# EAGLE design bp_pic_programmer_v1 (EAGLE 5.07)
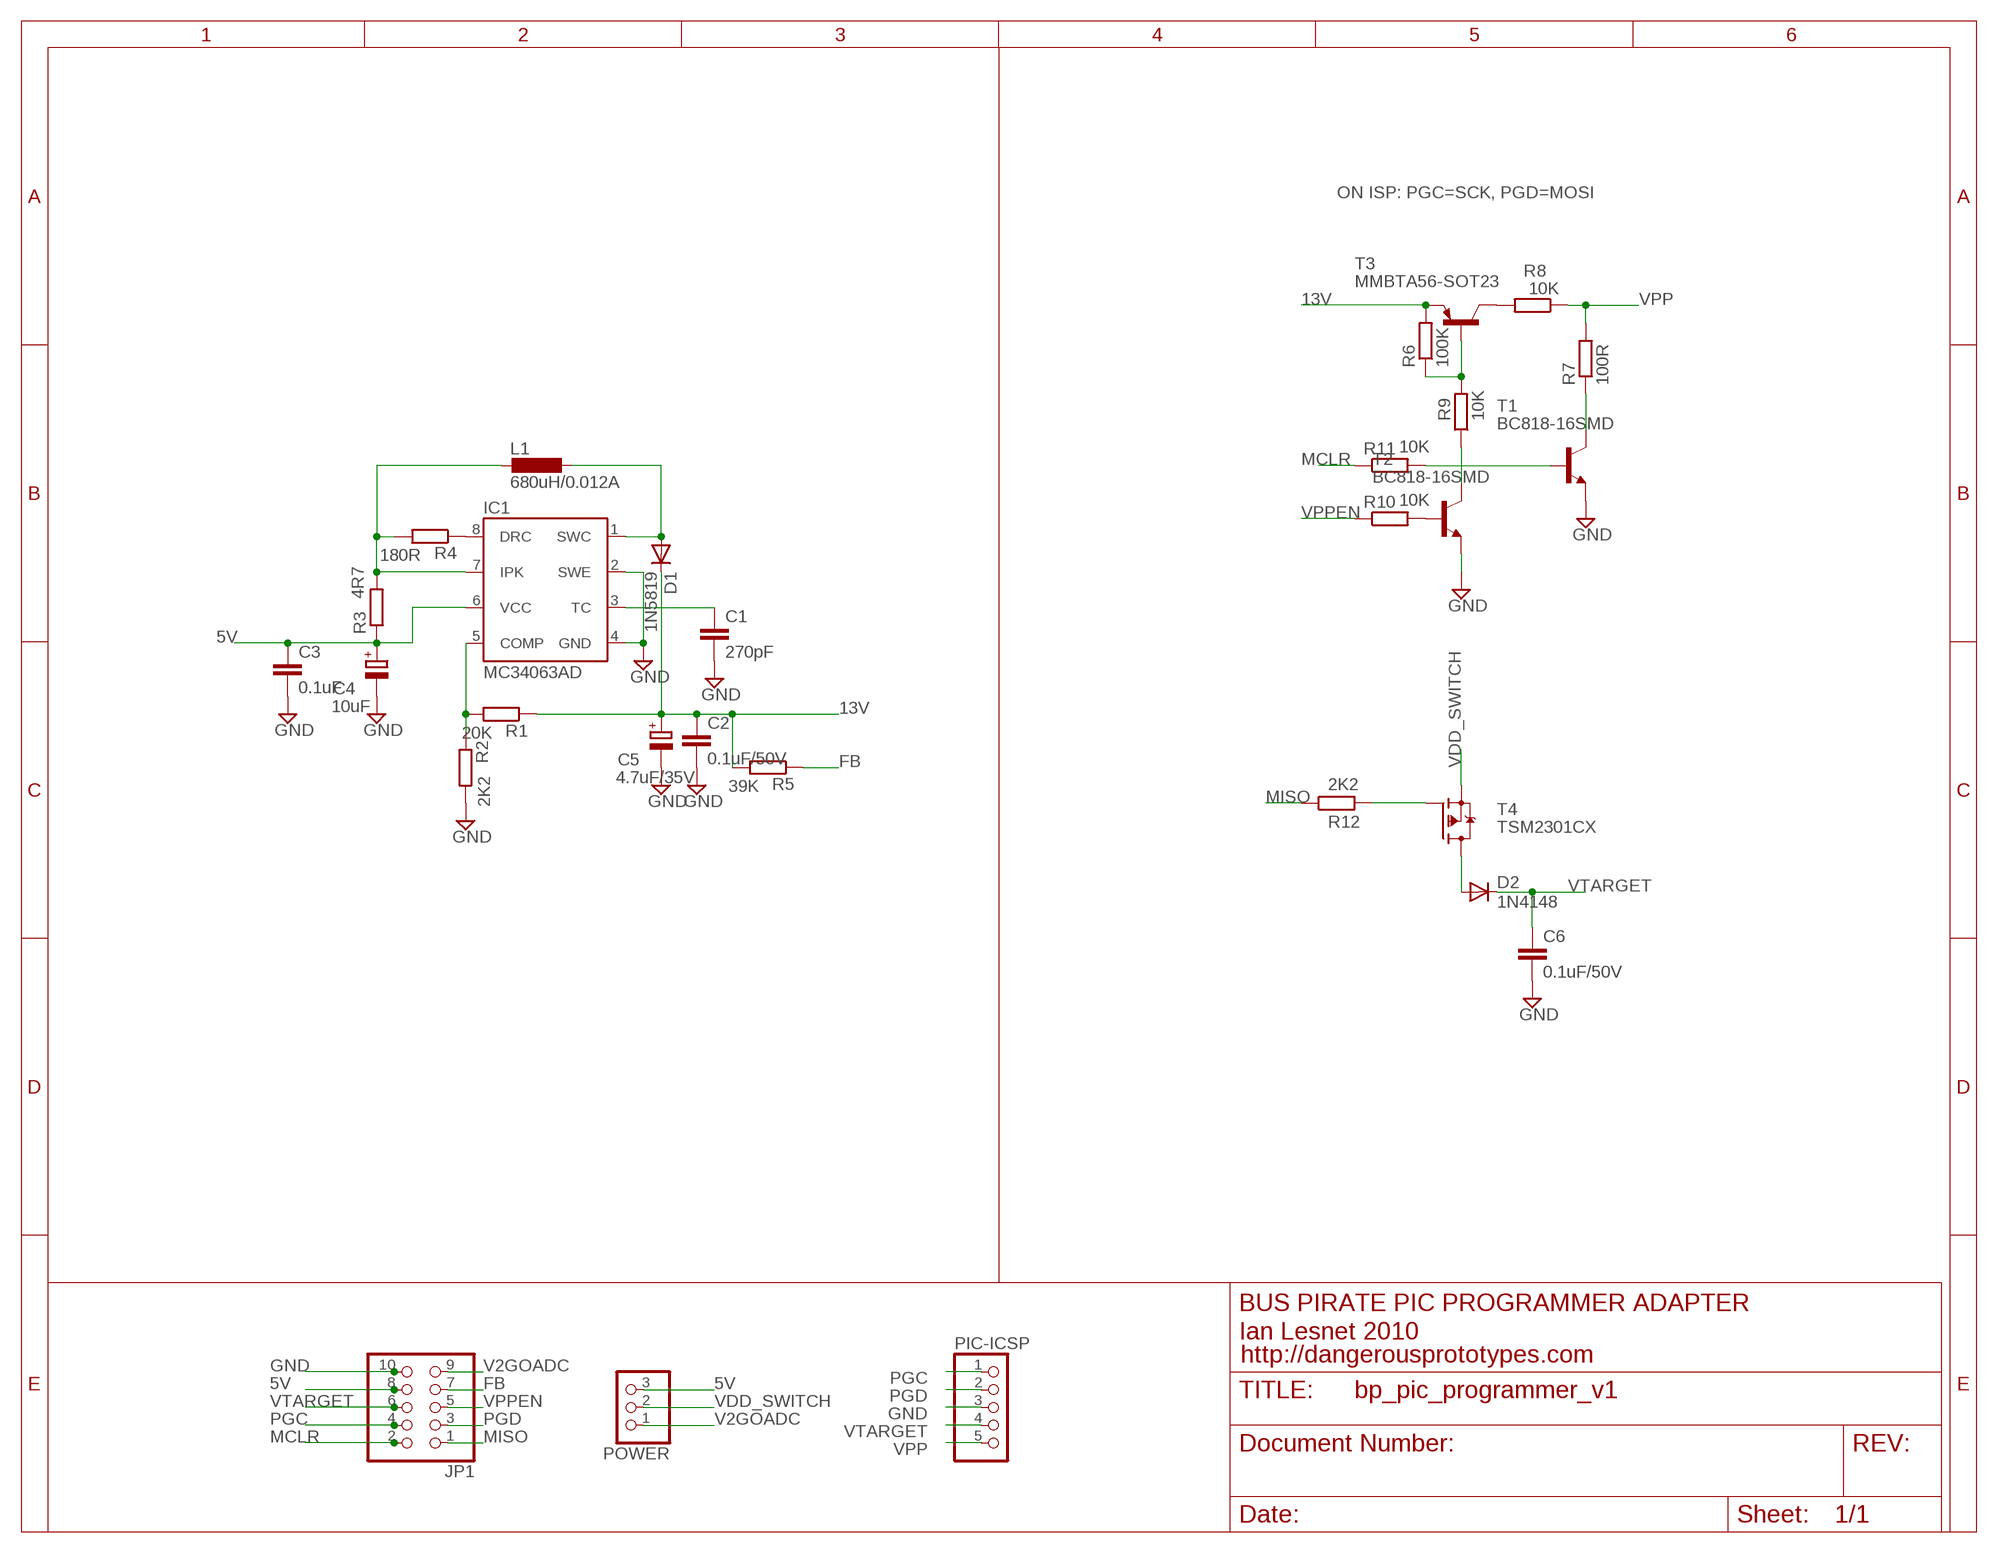
[diagram p0: schematic, sheet 1]

## Parts
C1  270pF  C-EUC0805K  [C0805K]
C2  0.1uF/50V  C-EUC0805K  [C0805K]
C3  0.1uF  C-EUC0805K  [C0805K]
C4  10uF  CPOL-EUSMCA  [SMC_A]
C5  4.7uF/35V  CPOL-EUSANYO_SMD_A5  [SANYO-OSCON_SMD_A5]
C6  0.1uF/50V  C-EUC0805K  [C0805K]
D1  1N5819  MBR0520LT  [SOD123]
D2  1N4148  DIODEDO323  [DO323]
IC1  MC34063AD  [SO08]
JP1  PINHD-2X5  [2X05]
L1  680uH/0.012A  L-EUL4532P  [L4532P]
PIC-ICSP  PINHD-1X5  [1X05]
POWER  PINHD-1X3  [1X03]
R1  20K  R-EU_M0805  [M0805]
R2  2K2  R-EU_M0805  [M0805]
R3  4R7  R-EU_M0805  [M0805]
R4  180R  R-EU_M0805  [M0805]
R5  39K  R-EU_M0805  [M0805]
R6  100K  R-EU_M0805  [M0805]
R7  100R  R-EU_M0805  [M0805]
R8  10K  R-EU_M0805  [M0805]
R9  10K  R-EU_M0805  [M0805]
R10  10K  R-EU_M0805  [M0805]
R11  10K  R-EU_M0805  [M0805]
R12  2K2  R-EU_M0805  [M0805]
T1  BC818-16SMD  [SOT23-BEC]
T2  BC818-16SMD  [SOT23-BEC]
T3  MMBTA56-SOT23  [SOT23]
T4  TSM2301CX  [SOT23]

## Nets
5V: C3.1 C4.+ IC1.6(VCC) JP1.8 POWER.3 R3.1
13V: C2.1 C5.+ D1.C R1.1 R5.2 R6.2 T3.2(E)
FB: JP1.7 R5.1
GND: C1.2 C2.2 C3.2 C4.- C5.- C6.2 IC1.2(SWE) IC1.4(GND) JP1.10 PIC-ICSP.3 R2.2 T1.E T2.E
MCLR: JP1.2 R11.1
MISO: JP1.1 R12.1
N$1: R12.2 T4.1(G)
N$3: R7.1 T1.C
N$4: R8.2 T3.3(C)
N$5: R9.1 T2.C
N$6: R6.1 R9.2 T3.1(B)
N$7: R11.2 T1.B
N$8: R10.2 T2.B
N$9: IC1.8(DRC) R4.1
N$10: D2.A T4.3(D)
N$11: IC1.7(IPK) L1.2 R3.2 R4.2
N$14: IC1.5(COMP) R1.2 R2.1
N$17: D1.A IC1.1(SWC) L1.1
N$19: C1.1 IC1.3(TC)
PGC: JP1.4 PIC-ICSP.5
PGD: JP1.3 PIC-ICSP.4
V2GOADC: JP1.9 POWER.1
VDD_SWITCH: POWER.2 T4.2(S)
VPP: PIC-ICSP.1 R7.2 R8.1
VPPEN: JP1.5 R10.1
VTARGET: C6.1 D2.C JP1.6 PIC-ICSP.2

## Notes on the sheet
- ON ISP: PGC=SCK, PGD=MOSI
- BUS PIRATE PIC PROGRAMMER ADAPTER
- Ian Lesnet 2010
- http://dangerousprototypes.com

## Library data of the parts
C1-C3 C6 = rcl:C-EU: CAPACITOR, European symbol
C4 C5 = rcl:CPOL-EU: POLARIZED CAPACITOR, European symbol
D1 = diode:MBR0520LT: SCHOTTKY BARRIER RECTIFIER Source: http://onsemi.com .. MBR0520LT1-D.pdf
D2 = DP-EagleLibrary:DIODE
IC1 = v-reg-3:MC34063A: 1.5A Step-Up/Down/Inverting Switching Regulator NPN Darlington Switch, Vin 3V to 40V, Current Limiter Input, adjustable Frequency up to 100kHz
JP1 = pinhead-2:PINHD-2X5: PIN HEADER
L1 = rcl:L-EU: INDUCTOR, European symbol
PIC-ICSP = pinhead-2:PINHD-1X5: PIN HEADER
POWER = pinhead-2:PINHD-1X3: PIN HEADER
R1-R12 = rcl:R-EU_: RESISTOR, European symbol
T1 T2 = transistor-npn:BC818*: NPN Transistor
T3 = transistor-pnp:*-?: PNP Transistor
T4 = dp_devices:TSM2301CX: 20V P-Channel Enhancement Mode MOSFET

## Board
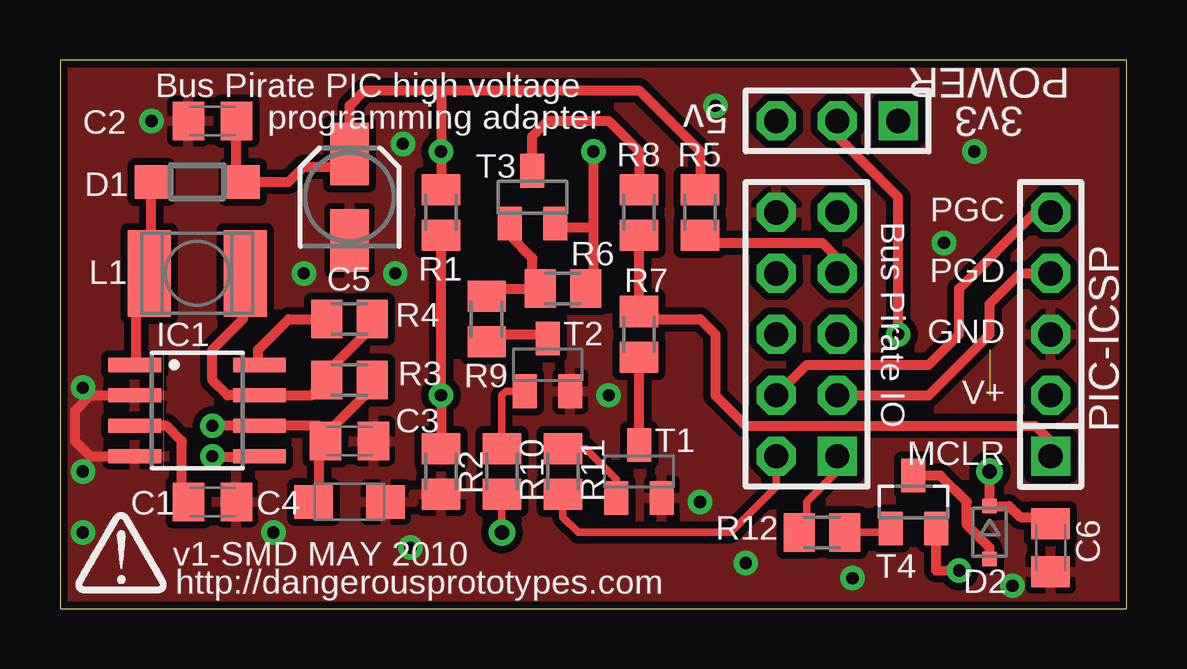
[diagram p1: board, top side]
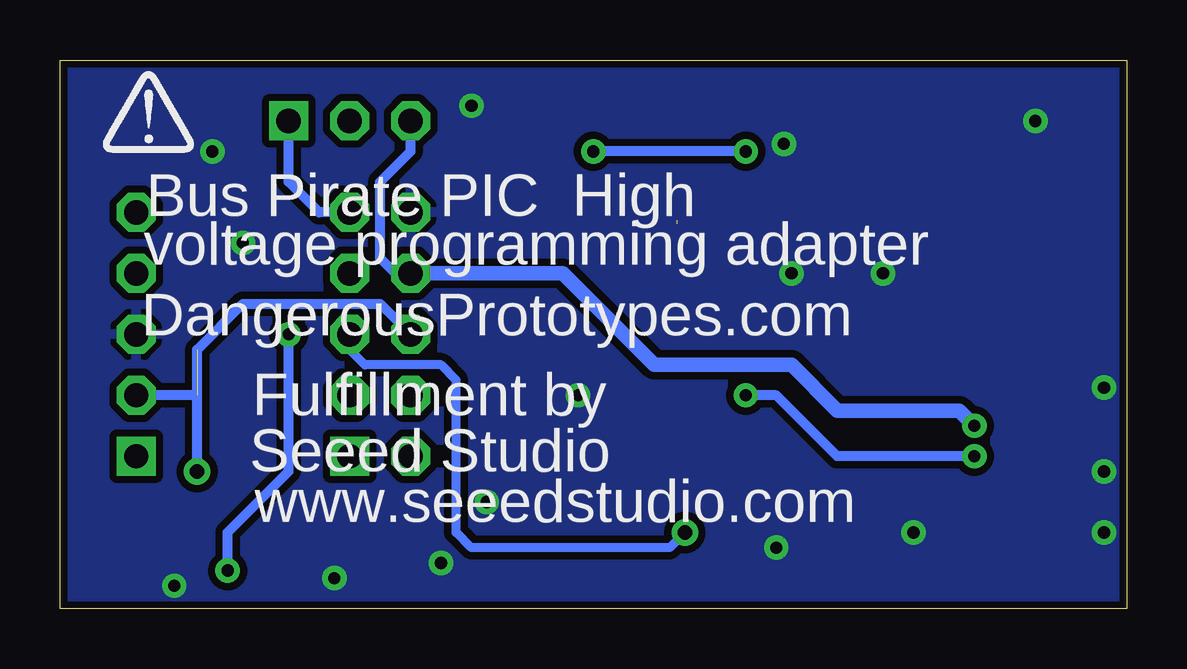
[diagram p2: board, bottom side, seen from below]

Size 44.45 x 22.86 mm. Coordinates in mm from the lower left corner, seen from the top.
Outline: 0,0 44.45,0 44.45,22.86 0,22.86 0,0
Copper layers (1*16): Top 0.035mm / dielectric 1.5mm / Bottom 0.035mm
Design rules "SparkFun": minimum track width 8mil, minimum drill 20mil, track to track 8mil, track to pad 8mil, pad to pad 8mil, via to via 8mil, smd to smd 8mil, copper to edge 10mil, drill to drill 8mil, minimum pad ring 12mil, minimum via ring 10mil, stop-mask expansion 4mil, vias tented up to drill 25mil, thermal gap 10mil

### Footprints (pad centres in the part's own frame; a part is rotated, then mirrored left to right if it is on the bottom)
C0805K = smd 1.3 x 1.6: 1 -1,0; 2 1,0
SMC_A = smd 1.6 x 1.4: + -1.5,0; - 1.5,0
SANYO-OSCON_SMD_A5 = smd 2.6 x 1.6: + 1.8,0; - -1.8,0
SOD123 = smd 1.4 x 1.4: A 1.9,0; C -1.9,0
DO323 = smd 0.6 x 0.6: A 1.1,0; C -1.1,0
SO08 = smd 0.6 x 2.2: 1 -1.905,-2.6; 2 -0.635,-2.6; 3 0.635,-2.6; 4 1.905,-2.6; 5 1.905,2.6; 6 0.635,2.6; 7 -0.635,2.6; 8 -1.905,2.6
2X05 = drill 1.016 square: 1 -5.08,-1.27 | drill 1.016 octagon: 2 -5.08,1.27; 3 -2.54,-1.27; 4 -2.54,1.27; 5 0,-1.27; 6 0,1.27; 7 2.54,-1.27; 8 2.54,1.27; 9 5.08,-1.27; 10 5.08,1.27
L4532P = smd 1.8 x 3.6: 1 -2,0; 2 2,0
1X05 = drill 1.016 square: 1 -5.08,0 | drill 1.016 octagon: 2 -2.54,0; 3 0,0; 4 2.54,0; 5 5.08,0
1X03 = drill 1.016 square: 1 -2.54,0 | drill 1.016 octagon: 2 0,0; 3 2.54,0
M0805 = smd 1.3 x 1.6: 1 -0.95,0; 2 0.95,0
SOT23-BEC = smd 1 x 1.4: B -0.95,-1.1; C 0,1.1; E 0.95,-1.1
SOT23 = smd 1 x 1.4: 1 -0.95,-1.1; 2 0.95,-1.1; 3 0,1.1

### Placement (x,y rotation side)
C1  6.35,4.45 0 top
C2  6.35,20.32 180 top
C3  12.06,6.98 0 top
C4  12.06,4.45 0 top
C5  12.06,17.15 90 top
C6  41.28,2.54 270 top
D1  5.72,17.78 180 top
D2  38.73,3.18 270 top
IC1  5.72,8.26 270 top
JP1  31.12,11.43 90 top
L1  5.72,13.97 0 top
PIC-ICSP  41.28,11.43 90 top
POWER  32.39,20.32 180 top
R1  15.88,16.51 270 top
R2  15.88,5.71 270 top
R3  12.06,9.53 180 top
R4  12.06,12.06 0 top
R5  26.67,16.51 90 top
R6  20.95,13.33 0 top
R7  24.13,11.43 90 top
R8  24.13,16.51 90 top
R9  17.78,12.06 90 top
R10  18.41,5.71 90 top
R11  20.95,5.71 90 top
R12  31.75,3.18 0 top
T1  24.13,5.71 0 top
T2  20.32,10.16 0 top
T3  19.69,17.15 0 top
T4  35.56,4.45 0 top
U$1  [DP-LOGO]  0.63,0.63 0 top
U$2  [DP-LOGO]  42.67,19 0 bottom

### Tracks (layer width: path | path; a pad name or v marks a point on that pad's centre or on a via)
5V  (via drill 0.51)
  Top 0.406: 10.8,6.98 C3.1 11.43,7.35 11.43,7.62 12.7,8.89 12.7,9.21 R3.1 13.34,9.21 | v6.35,7.62 IC1.6 10.8,7.62 10.8,6.98 | 10.8,6.98 10.8,4.68 C4.+ 10.74,4.45 10.69,4.39
  Bottom 0.406: POWER.3 29.84,19.05 31.12,17.78 31.12,14.6 30.48,13.97 JP1.8
  Bottom 0.61: JP1.8 23.49,13.97 19.69,10.16 13.97,10.16 12.06,8.26 6.98,8.26 v6.35,7.62
13V  (via drill 0.51)
  Top 0.406: C2.1 7.35,18.05 D1.C 9.52,17.78 10.16,18.41 12.06,18.41 C5.+ | C5.+ 12.22,19.1 | R1.1 v15.88,19.05 15.88,21.59 | R5.2 26.67,19.05 24.13,21.59 15.88,21.59 | 15.88,21.59 12.7,21.59 12.06,20.95 C5.+ | R6.2 22.23,13.33 22.23,15.87 | T3.2 20.78,16.05 20.95,15.87 22.23,15.87 | v22.23,19.05 22.23,15.87
  Bottom 0.406: v15.88,19.05 v22.23,19.05
FB
  Top 0.406: JP1.7 32.39,14.6 31.75,15.24 26.99,15.24 R5.1
GND  (via drill 0.51)
  Top 0.406: IC1.2 1.27,8.89 0.63,8.26 0.63,6.98 1.27,6.35 IC1.4
  other vias: 26.67,4.45 22.86,8.89 10.16,13.97 13.97,13.97 0.95,3.18 14.6,2.54 8.89,3.18 0.95,9.21 0.95,5.71 38.1,19.05 27.3,20.95 28.58,1.91 39.69,0.95 3.81,20.32 14.29,19.37 36.83,15.24 33.02,1.27
  pour Bottom (isolate 0.305): 0,22.86 0,0 44.45,0 44.45,22.86
  pour Top (isolate 0.305): 0,22.86 44.45,22.86 44.45,0 0,0
MCLR
  Top 0.305: JP1.2 29.84,5.08 27.94,3.18 21.59,3.18 20.95,3.81 R11.1
MISO
  Top 0.305: JP1.1 32.39,5.71 31.12,4.45 31.12,3.49 R12.1
N$1
  Top 0.305: T4.1 34.61,2.85 34.29,3.18 R12.2
N$3
  Top 0.406: T1.C R7.1
N$4
  Top 0.406: R8.2 24.13,19.05 22.86,20.32 20.32,20.32 19.69,19.69 T3.3
N$5
  Top 0.406: T2.C 20.32,11.43 18.09,11.43 R9.1
N$6  (1 unrouted)
  Top 0.406: 18.41,16.51 18.73,16.19 | R9.2 18.1,13.33 R6.1 19.69,13.65 19.69,14.6 18.73,15.56 T3.1
N$7
  Top 0.305: T1.B 23.18,5.39 21.91,6.66 R11.2
N$8
  Top 0.305: T2.B 18.59,9.06 18.41,8.89 R10.2
N$9
  Top 0.406: R4.1 9.52,12.06 8.26,10.79 8.26,10.22 IC1.8
N$10
  Top 0.406: T4.3 36.68,5.54 37.78,4.45 37.78,3.49 38.73,2.54 D2.A
N$11
  Top 0.406: R4.2 12.7,11.75 12.7,11.43 11.12,9.85 R3.2 10.48,8.89 IC1.7 6.98,8.89 6.35,9.53 6.35,10.79 7.62,12.06 7.62,13.97 L1.2
N$14  (via drill 0.51)
  Top 0.406: IC1.5 8.29,6.32 6.33,6.32 v6.35,6.35 | R2.1 v15.88,8.89 R1.2
  Bottom 0.406: v6.35,6.35 12.06,6.35 14.6,8.89 v15.88,8.89
N$17
  Top 0.406: 3.72,17.68 D1.A 3.81,13.97 L1.1 3.12,13.37 3.17,13.31 3.17,10.16 IC1.1
N$19
  Top 0.406: IC1.3 4.45,7.62 5.08,6.98 5.08,4.08 C1.1
PGC
  Top 0.406: JP1.4 31.12,10.16 36.19,10.16 37.47,11.43 37.47,13.33 40.64,16.51 PIC-ICSP.5
PGD
  Top 0.406: JP1.3 36.19,8.89 38.73,11.43 38.73,12.7 40,13.97 PIC-ICSP.4
V2GOADC
  Bottom 0.406: JP1.9 33.66,16.51 34.92,17.78 POWER.1
VDD_SWITCH  (via drill 0.51)
  Top 0.406: POWER.2 32.39,19.69 34.92,17.15 v34.92,11.43 | T4.2 36.51,1.59 v37.47,1.59
  Bottom 0.406: v34.92,11.43 34.92,5.71 37.47,3.18 v37.47,1.59
VPP
  Top 0.305: R7.2 24.77,12.06
  Top 0.406: R8.1 R7.2 24.8,12.19 | PIC-ICSP.1 41.28,6.98 40.64,7.62 28.58,7.62 27.3,8.89 27.3,11.43 26.67,12.06 24.77,12.06
VPPEN  (via drill 0.6)
  Top 0.305: R10.1 v18.41,3.18
  Bottom 0.381: v18.41,3.18 19.05,2.54 27.3,2.54 27.94,3.18 27.94,9.53 28.58,10.16 31.75,10.16 32.39,10.79 JP1.5
VTARGET  (via drill 0.6)  (1 unrouted)
  Top 0.406: v38.73,5.71 D2.C 39.54,4.28 40,3.81 41,3.81 C6.1
  Bottom 0.406: JP1.6 31.12,12.7 36.83,12.7 38.73,10.79 v38.73,5.71 | 38.73,8.89 PIC-ICSP.2

### Text on the board
tPlace: Bus Pirate PIC high voltage | programming adapter | PGC | Bus Pirate IO | PGD | GND | V+ | MCLR | v1-SMD MAY 2010 | http://dangerousprototypes.com
tNames: 5v | 3v3
bNames: Bus Pirate PIC High | voltage programming adapter | DangerousPrototypes.com | Fulfillment by | Seeed Studio | www.seeedstudio.com